# Altium schematic sheet L293DD.SchDoc
size B
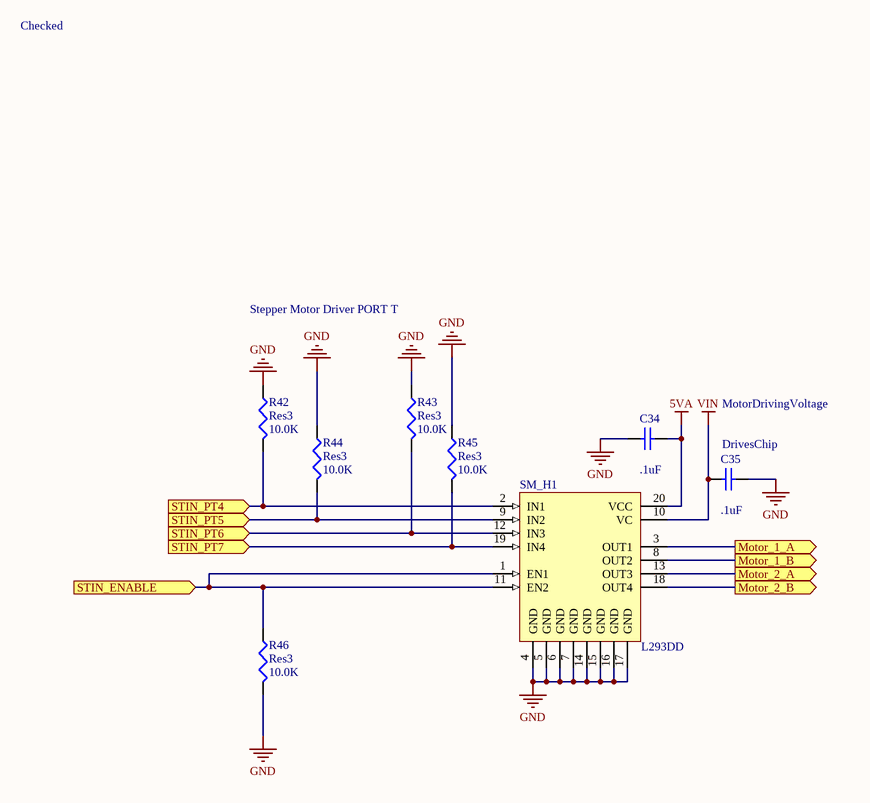
[diagram p0: L293DD.SchDoc]

## Parts
C34  value .1uF  [CAPC2012X09M]  (hidden comment: Cap)
C35  value .1uF  [CAPC2012X09M]  (hidden comment: Cap)
R42  Res3  value 10.0K  [RESC2112X05M]
R43  Res3  value 10.0K  [RESC2112X05M]
R44  Res3  value 10.0K  [RESC2112X05M]
R45  Res3  value 10.0K  [RESC2112X05M]
R46  Res3  value 10.0K  [RESC2112X05M]
SM_H1  L293DD  [SO20_N]

## Ports
Motor_1_A (out), Motor_1_B (out), Motor_2_A (out), Motor_2_B (out), STIN_ENABLE (in), STIN_PT4 (in), STIN_PT5 (in), STIN_PT6 (in), STIN_PT7 (in)

## Nets
5VA: C34.2 SM_H1.20(VCC)
GND: C34.1 C35.2 R42.1 R43.1 R44.1 R45.1 R46.2 SM_H1.4(GND) SM_H1.5(GND) SM_H1.6(GND) SM_H1.7(GND) SM_H1.14(GND) SM_H1.15(GND) SM_H1.16(GND) SM_H1.17(GND)
VIN: C35.1 SM_H1.10(VC)
Motor_1_A: SM_H1.3(OUT1) ; port Motor_1_A
Motor_1_B: SM_H1.8(OUT2) ; port Motor_1_B
Motor_2_A: SM_H1.13(OUT3) ; port Motor_2_A
Motor_2_B: SM_H1.18(OUT4) ; port Motor_2_B
STIN_ENABLE: R46.1 SM_H1.1(EN1) SM_H1.11(EN2) ; port STIN_ENABLE
STIN_PT4: R42.2 SM_H1.2(IN1) ; port STIN_PT4
STIN_PT5: R44.2 SM_H1.9(IN2) ; port STIN_PT5
STIN_PT6: R43.2 SM_H1.12(IN3) ; port STIN_PT6
STIN_PT7: R45.2 SM_H1.19(IN4) ; port STIN_PT7

## Notes on the sheet
- Checked
- Stepper Motor Driver PORT T
- MotorDrivingVoltage
- (near C35) DrivesChip
- ESE
- is the sole property of ESE. Any reproduction
- The Information Contained in this drawing
- Schematic P/N and Name
- Sheet Name
- 299 Doon Valley Drive
- Kitchener, ON N2G 4M4
- Canada
- Approved
- in part or in whole without the written
- permission of ESE is strictly prohibited.
- APPROVALS
- DATE
- Size
- Scale
- B
- NTS
- Bare PCB P/N
- Date
- Sheet
- Rev.
- Engineer
- of

## Library data of the parts
C34 C35 = CAP-X7R-.1uF-50V-±20%: CAP CER .1uF 50v X7R 0805; MPN: C0805C104M5RACTU; WV: 50; Tolerance: ±20%; PN: 399-1169-1-ND; Name: CAP-X7R-.1uF-50V-±20%; Type: X7R; URL: http://www.digikey.ca/product-detail/en/C0805C104M5RACTU/399-1169-1-ND
R42-R46 = Resistor_10.0K: RES SMD 10.0K OHM 1% 1/8W 0805; MPN: CRCW080510K0FKEA; PN: 541-10.0KCCT-ND; Name: Resistor_10.0K; URL: http://www.digikey.ca/product-detail/en/CRCW080510K0FKEA/541-10.0KCCT-ND
SM_H1 = L293DD: Push-Pull Four Channel Driver With Diode; PN: 497-2937-1-ND; Published: 8-Jun-2000; LatestRevisionDate: 13-Apr-2006; LatestRevisionNote: IPC-7351 Footprint Added.; DatasheetVersion: Jun-1996; PackageVersion: Jul-2001; PackageReference: SO20; Publisher: Altium Limited; PackageDescription: 20-Pin Plastic Small Outline Integrated Circuit 1.27 mm Pitch; Code_JEDEC: MS-013-AC; Code_IPC: SOIC127P1030-20; ComponentLink1Description: Manufacturer Link; ComponentLink1URL: http://www.st.com/; ComponentLink2Description: Datasheet; ComponentLink2URL: http://www.st.com/stonline/products/literature/ds/1330/l293d.pdf; URL: http://www.digikey.ca/product-detail/en/L293DD013TR/497-2937-1-ND/634902